# EAGLE schematic arduino_katakana_dictionary (EAGLE 9.6.2)
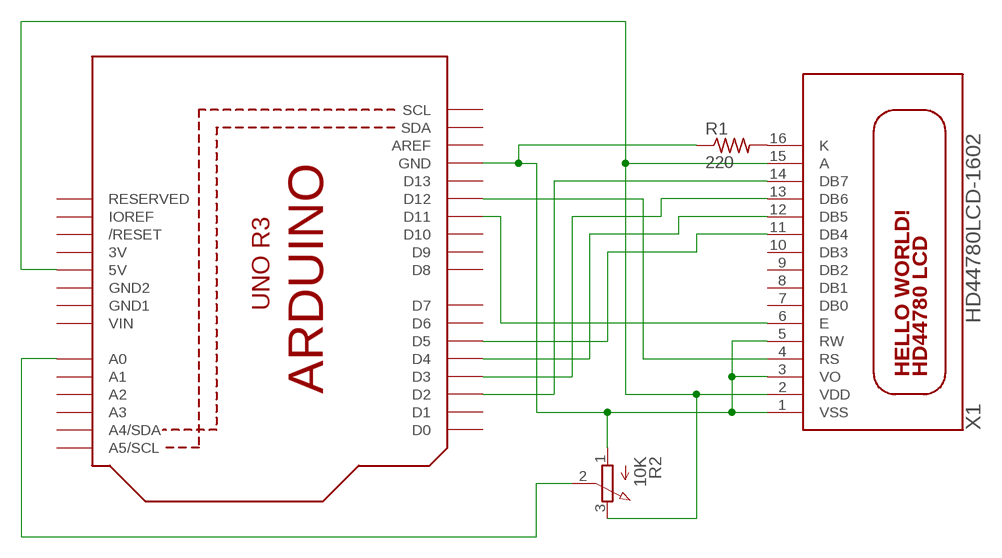
[diagram p0: schematic, sheet 1]

## Parts
R1  220  R-US_0204/5  [0204/5]
R2  10K  3RP/1610N  [3RP/1610N]
U1  ARDUINOR3-DIMENSION  [ARDUINOR3]
X1  HD44780LCD-1602  [LCD1602]

## Nets
N$1: U1.D12 X1.4(RS)
N$2: U1.D2 X1.14(DB7)
N$3: U1.D3 X1.13(DB6)
N$4: U1.D4 X1.12(DB5)
N$5: U1.D5 X1.11(DB4)
N$6: U1.D11 X1.6(E)
N$7: R2.2(S) U1.A0
N$8: R1.2 X1.16(K)
VDD: R2.3(E) U1.5V X1.2(VDD) X1.15(A)
VSS: R1.1 R2.1(A) U1.GND X1.1(VSS) X1.3(VO) X1.5(RW)
Unconnected: U1.A1 U1.A2 U1.A3 U1.A4(A4/SDA) U1.A5(A5/SCL) U1.AREF U1.D0 U1.D1 U1.D6 U1.D7 U1.D8 U1.D9 U1.D10 U1.D13 U1.IOREF U1.RESERVED U1.RESET(/RESET) U1.SCL U1.SDA X1.7(DB0) X1.8(DB1) X1.9(DB2) X1.10(DB3)

## Power pins joined to a net without a drawn wire
3V: U1.3V
GND1: U1.GND1
GND2: U1.GND2
VIN: U1.VIN

## Library data of the parts
R1 = adafruit:R-US_: RESISTOR, American symbol
R2 = pot:3RP/1610N: 16mm Potentiometer one level Source: http://www.alphapotentiometers.net/html/16mm_pot_2.html
U1 = adafruit:ARDUINOR3: This is a new object for the new Arduino R3 - with extra pins that you may want to use (such as IOref, and duplicated A4/A5
X1 = adafruit:HD44780LCD: HD44780 LCD Standard character type LCDs, available in sizes from 8x1 to 40x4!